# Altium project KIT_ARDUINO_V1.0.PrjPcb
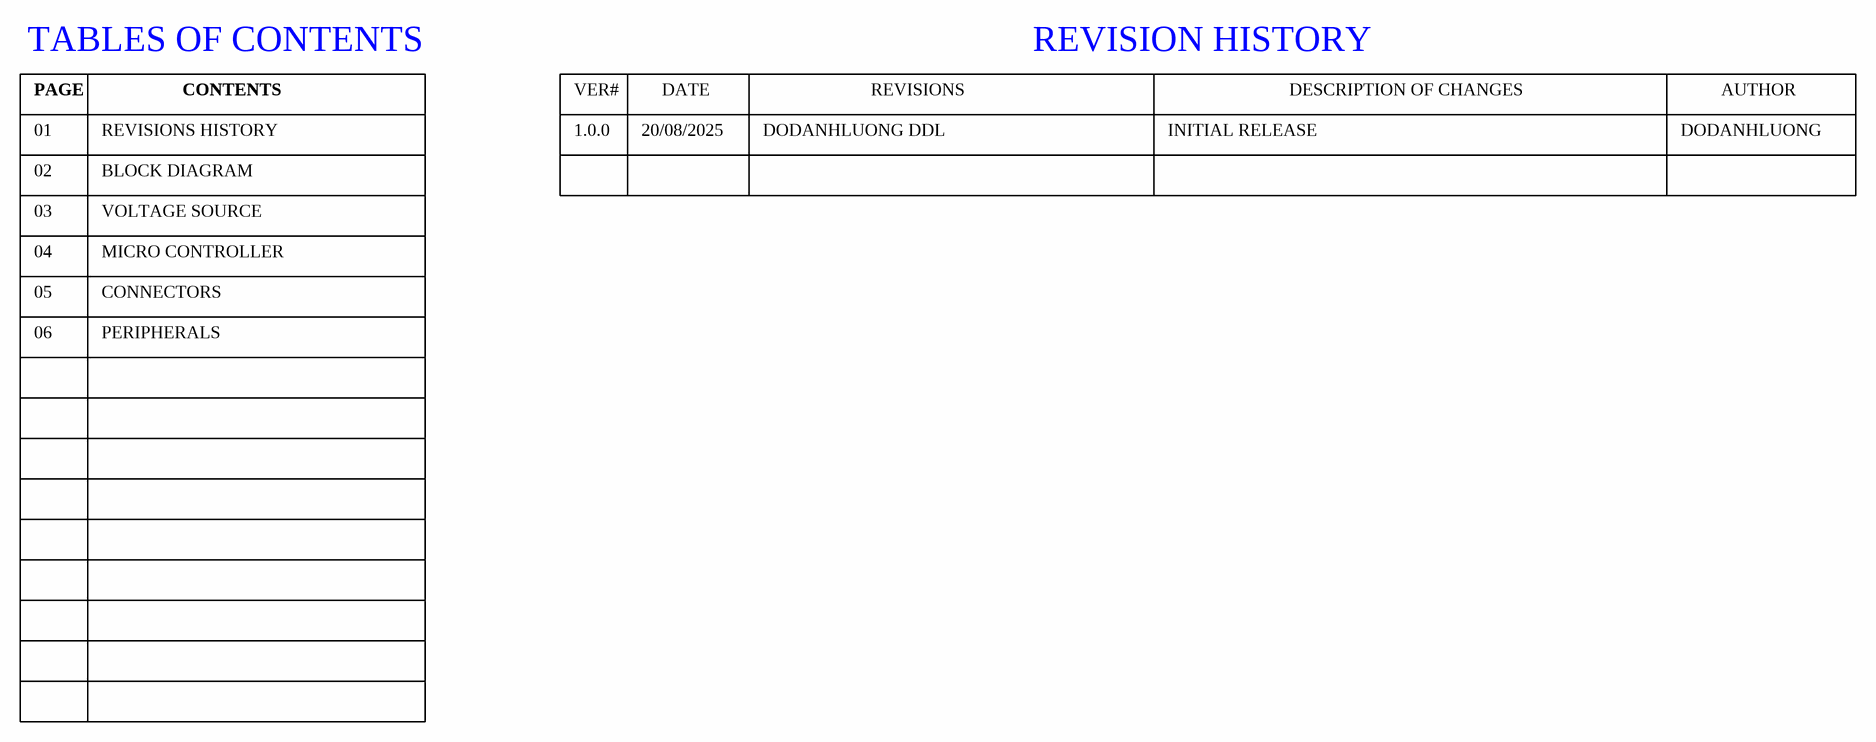
[diagram p0: Revisions History.SchDoc]
6 sheets, 97 parts. Net scope: global (net labels, ports and power ports of the same name join across sheets).
Board files: PCB.PcbDoc, Assembly.PcbDoc
Sheets:
  Revisions History.SchDoc
  Block Diagram.SchDoc
  Voltage Source.SchDoc
  Micro Controller.SchDoc
  Connector.SchDoc
  Peripheral.SchDoc

## Sheet Revisions History.SchDoc: Revisions History
size A3; Author: DODANHLUONG; Revision: 1.0; SheetNumber: 1; SheetTotal: 6; ProjectTitle: KIT ARDUINO VERSION 1.0

### Notes on the sheet
- TABLES OF CONTENTS
- REVISION HISTORY
- PAGE
- 01
- REVISIONS HISTORY
- CONTENTS
- VER#
- 1.0.0
- 20/08/2025
- DATE
- DODANHLUONG DDL
- REVISIONS
- INITIAL RELEASE
- DESCRIPTION OF CHANGES
- DODANHLUONG
- AUTHOR
- 02
- BLOCK DIAGRAM
- 03
- 04
- MICRO CONTROLLER
- VOLTAGE SOURCE
- 05
- 06
- CONNECTORS
- PERIPHERALS
- Author:
- Title:
- Size:
- A3
- Project:
- Revision:
- Modified Date:
- CheckedBy:
- Date:
- SW Version:

## Sheet Block Diagram.SchDoc: Block Diagram
size A4; Author: DODANHLUONG; Revision: 1.0; SheetNumber: 2; SheetTotal: 6; ProjectTitle: KIT ARDUINO VERSION 1.0

### Notes on the sheet
- Author:
- Title:
- Size:
- A4
- Project:
- Approved:
- Revision:
- Modified Date:
- CONFIDENTIAL
- Date:
- SW Version:

## Sheet Voltage Source.SchDoc: Voltage Source
size A4; Author: DODANHLUONG; Revision: 1.0; SheetNumber: 3; SheetTotal: 6; ProjectTitle: KIT ARDUINO VERSION 1.0
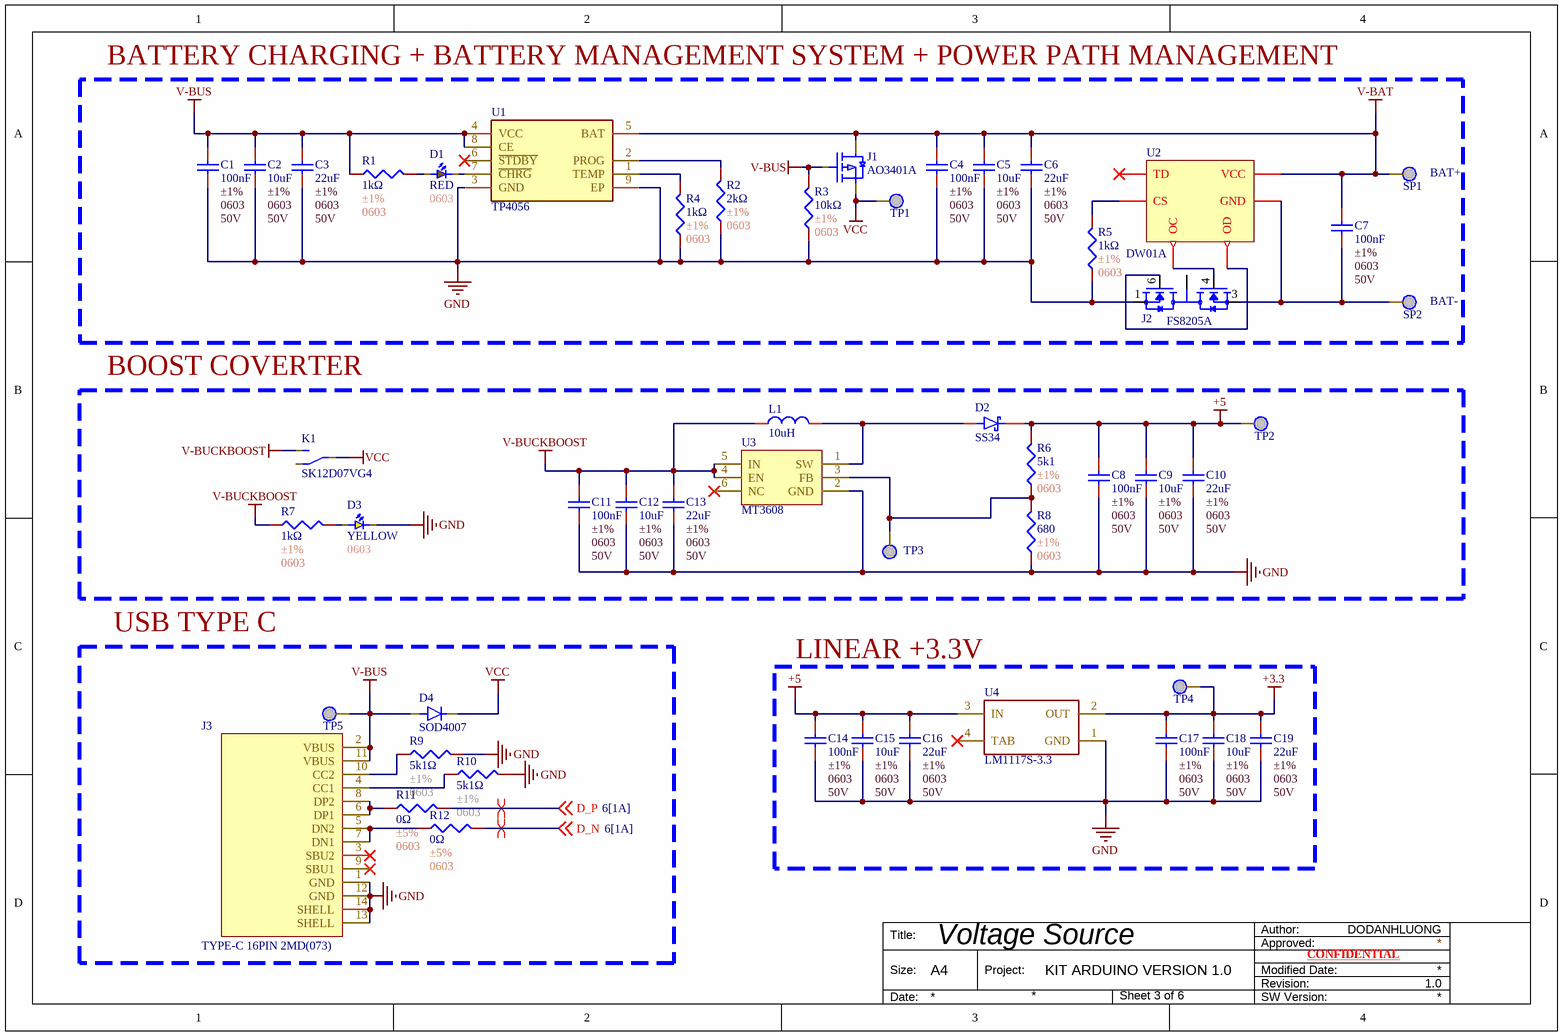
[diagram p1: Voltage Source.SchDoc]

### Parts
C1  100nF  Tolerance: ±1%  Package: 0603  Voltage Rating: 50V  [C0603]
C2  10uF  Tolerance: ±1%  Package: 0603  Voltage Rating: 50V  [C0603]
C3  22uF  Tolerance: ±1%  Package: 0603  Voltage Rating: 50V  [C0603]
C4  100nF  Tolerance: ±1%  Package: 0603  Voltage Rating: 50V  [C0603]
C5  10uF  Tolerance: ±1%  Package: 0603  Voltage Rating: 50V  [C0603]
C6  22uF  Tolerance: ±1%  Package: 0603  Voltage Rating: 50V  [C0603]
C7  100nF  Tolerance: ±1%  Package: 0603  Voltage Rating: 50V  [C0603]
C8  100nF  Tolerance: ±1%  Package: 0603  Voltage Rating: 50V  [C0603]
C9  10uF  Tolerance: ±1%  Package: 0603  Voltage Rating: 50V  [C0603]
C10  22uF  Tolerance: ±1%  Package: 0603  Voltage Rating: 50V  [C0603]
C11  100nF  Tolerance: ±1%  Package: 0603  Voltage Rating: 50V  [C0603]
C12  10uF  Tolerance: ±1%  Package: 0603  Voltage Rating: 50V  [C0603]
C13  22uF  Tolerance: ±1%  Package: 0603  Voltage Rating: 50V  [C0603]
C14  100nF  Tolerance: ±1%  Package: 0603  Voltage Rating: 50V  [C0603]
C15  10uF  Tolerance: ±1%  Package: 0603  Voltage Rating: 50V  [C0603]
C16  22uF  Tolerance: ±1%  Package: 0603  Voltage Rating: 50V  [C0603]
C17  100nF  Tolerance: ±1%  Package: 0603  Voltage Rating: 50V  [C0603]
C18  10uF  Tolerance: ±1%  Package: 0603  Voltage Rating: 50V  [C0603]
C19  22uF  Tolerance: ±1%  Package: 0603  Voltage Rating: 50V  [C0603]
D1  RED  Package: 0603  [LED0603]
D2  SS34  [SS34]
D3  YELLOW  Package: 0603  [LED0603]
D4  SOD4007  [SOD4007]
J1  AO3401A  [AO3401A]
J2  FS8205A  [FS8205A]
J3  TYPE-C 16PIN 2MD(073)  [TYPE_C_FAMALE]
K1  SK12D07VG4  [SK12D07VG4]
L1  10uH  [CD43]
R1  1kΩ  Tolerance: ±1%  Package: 0603  [R0603]
R2  2kΩ  Tolerance: ±1%  Package: 0603  [R0603]
R3  10kΩ  Tolerance: ±1%  Package: 0603  [R0603]
R4  1kΩ  Tolerance: ±1%  Package: 0603  [R0603]
R5  1kΩ  Tolerance: ±1%  Package: 0603  [R0603]
R6  5k1  Tolerance: ±1%  Package: 0603  [R0603]
R7  1kΩ  Tolerance: ±1%  Package: 0603  [R0603]
R8  680  Tolerance: ±1%  Package: 0603  [R0603]
R9  5k1Ω  Tolerance: ±1%  Package: 0603  [R0603]
R10  5k1Ω  Tolerance: ±1%  Package: 0603  [R0603]
R11  0Ω  Tolerance: ±5%  Package: 0603  [R0603]
R12  0Ω  Tolerance: ±5%  Package: 0603  [R0603]
SP1  BAT+  [SP]
SP2  BAT-  [SP]
TP1  TP  [TP]  (value not drawn)
TP2  TP  [TP]  (value not drawn)
TP3  TP  [TP]  (value not drawn)
TP4  TP  [TP]  (value not drawn)
TP5  TP  [TP]  (value not drawn)
U1  TP4056  [TP4056]
U2  DW01A  [DW01A]
U3  MT3608  [MT3608]
U4  LM1117S-3.3  [AMS1117-3.3]

### Blocks framed on the sheet
BOOST COVERTER: C8-C13 D2 D3 K1 L1 R6-R8 TP2 TP3 U3
USB TYPE C: D4 J3 R9-R12 TP5
LINEAR +3.3V: C14-C19 TP4 U4

### Nets
+3.3: C17.1 C18.1 C19.1 TP4.1 U4.2(OUT)
+5: C8.1 C9.1 C10.1 C14.1 C15.1 C16.1 D2.1 R6.2 TP2.1 U4.3(IN)
GND: C1.2 C2.2 C3.2 C4.2 C5.2 C6.2 C8.2 C9.2 C10.2 C11.2 C12.2 C13.2 C14.2 C15.2 C16.2 C17.2 C18.2 C19.2 D3.1 J2.1(S1) J3.1(GND) J3.12(GND) J3.13(SHELL) J3.14(SHELL) R2.1 R3.1 R4.1 R5.1 R8.1 R9.2 R10.2 U1.3(GND) U1.9(EP) U3.2(GND) U4.1(GND)
V-BAT: C4.1 C5.1 C6.1 C7.1 J1.3(D) SP1.1 U1.5(BAT) U2.5(VCC)
V-BUCKBOOST: C11.1 C12.1 C13.1 K1.1 L1.1 R7.1 U3.4(EN) U3.5(IN)
V-BUS: C1.1 C2.1 C3.1 D4.2(A) J1.1(G) J3.2(VBUS) J3.11(VBUS) R1.1 R3.2 TP5.1 U1.4(VCC) U1.8(CE)
VCC: D4.1(C) J1.2(S) K1.2 TP1.1
D_N: R12.2 ; off-sheet D_N
D_P: R11.2 ; off-sheet D_P
NetC7_2: C7.2 J2.3(S2) SP2.1 U2.6(GND)
NetD1_1: D1.1 U1.7(~{CHRG})
NetD1_2: D1.2 R1.2
NetD2_2: D2.2 L1.2 U3.1(SW)
NetD3_2: D3.2 R7.2
NetJ2_2: J2.2(D12) J2.5(D12)
NetJ2_4: J2.4(G2) U2.3(OC)
NetJ2_6: J2.6(G1) U2.1(OD)
NetJ3_4: J3.4(CC1) R10.1
NetJ3_5: J3.5(DN2) J3.7(DN1) R12.1
NetJ3_6: J3.6(DP1) J3.8(DP2) R11.1
NetJ3_10: J3.10(CC2) R9.1
NetR2_2: R2.2 U1.2(PROG)
NetR4_2: R4.2 U1.1(TEMP)
NetR5_2: R5.2 U2.2(CS)
NetR6_1: R6.1 R8.2 TP3.1 U3.3(FB)

Not connected (* = marked no-connect by the designer): J3 3(SBU2)* 9(SBU1)*; K1 3; U1 6(~{STDBY})*; U2 4(TD)*; U3 6(NC)*; U4 4(TAB)*

### Layout directives
differential pair: D_N, D_P

### Notes on the sheet
- BATTERY CHARGING + BATTERY MANAGEMENT SYSTEM + POWER PATH MANAGEMENT
- Author:
- Title:
- Size:
- A4
- Project:
- Approved:
- Revision:
- Modified Date:
- CONFIDENTIAL
- Date:
- SW Version:

### Library data of the parts
C1 C4 C7 C8 C11 C14 C17 = C0603_100nF_±1%: 50V 10pF NP0 ±1% 0402 Multilayer Ceramic Capacitors MLCC - SMD/SMT ROHS; Manufacturer: YAGEO; Mfr. Part #: CC0402FRNPO9BN100; LCSC Part #: C513681; Link: https://www.lcsc.com/product-detail/C513681.html?s_z=n_capital%2520yageo%252010pF%25200402; Capacitance: 100nF
C2 C5 C9 C12 C15 C18 = C0603_10uF_±1%: 50V 10pF NP0 ±1% 0402 Multilayer Ceramic Capacitors MLCC - SMD/SMT ROHS; Manufacturer: YAGEO; Mfr. Part #: CC0402FRNPO9BN100; LCSC Part #: C513681; Link: https://www.lcsc.com/product-detail/C513681.html?s_z=n_capital%2520yageo%252010pF%25200402; Capacitance: 10uF
C3 C6 C10 C13 C16 C19 = C0603_22uF_±1%: 50V 10pF NP0 ±1% 0402 Multilayer Ceramic Capacitors MLCC - SMD/SMT ROHS; Manufacturer: YAGEO; Mfr. Part #: CC0402FRNPO9BN100; LCSC Part #: C513681; Link: https://www.lcsc.com/product-detail/C513681.html?s_z=n_capital%2520yageo%252010pF%25200402; Capacitance: 22uF
D1 = D0603_RED: 25mcd~40mcd Water Clear -40℃~+85℃ 624nm Red 120° 60mW 0402 LED Indication - Discrete ROHS; Manufacturer: XINGLIGHT; Mfr. Part #: XL-1005UGC; Voltage - Forward(Vf): 3V; LCSC Part #: C965793; Power(Watts): 60mW; Link: https://www.lcsc.com/product-detail/C136765.html?s_z=n_LED%25200402%2520RED; Illumination Color: RED
D2 = SS34: 40V Independent 3A 550mV@3A SMA(DO-214AC) Schottky Diodes ROHS; Manufacturer: MDD(Microdiode Semiconductor); Mfr. Part #: SS34; LCSC Part #: C8678; Package: SMA(DO-214AC); Voltage - DC Reverse(Vr): 40V; Current - Rectified: 3A; Link: https://www.lcsc.com/product-detail/C8678.html?s_z=n_SS34
D3 = D0603_YELLOW: 25mcd~40mcd Water Clear -40℃~+85℃ 624nm Red 120° 60mW 0402 LED Indication - Discrete ROHS; Manufacturer: XINGLIGHT; Mfr. Part #: XL-1005UGC; Voltage - Forward(Vf): 3V; LCSC Part #: C965793; Power(Watts): 60mW; Link: https://www.lcsc.com/product-detail/C136765.html?s_z=n_LED%25200402%2520RED; Illumination Color: YELLOW
D4 = SOD4007: 1A Independent 1kV 1.1V@1A SOD-123FL Diodes - General Purpose ROHS; Manufacturer: MDD(Microdiode Semiconductor); Mfr. Part #: SOD4007; Package: SOD-123FL; LCSC Part #: C18124; Link: https://www.lcsc.com/product-detail/C18124.html?s_z=n_SOD4007; Voltage - DC Reverse(Vr): 1kV; Current - Rectified: 1A
J1 = AO3401: 30V 4A 900mV@250uA 1 P-Channel SOT-23 MOSFETs ROHS; Manufacturer: AOS; Mfr. Part #: AO3401A; LCSC Part #: C15127; Package: SOT-23; Current - Continuous Drain(Id): 4A; Drain to Source Voltage: 30V; Link: https://www.lcsc.com/product-detail/C15127.html?s_z=n_AO3401
J2 = FS8205A: 20V 9A 31.5mΩ@2.5V 1.5W 1.2V@250uA SOT-23-6 MOSFETs ROHS; Manufacturer: TECH PUBLIC; Mfr. Part #: FS8205A; Package: SOT-23-6; LCSC Part #: C2830320; Drain to Source Voltage: 20V; Current - Continuous Drain(Id): 9A; Link: https://www.lcsc.com/product-detail/C2830320.html?s_z=n_fs8205a
J3 = TYPE_C_FAMALE_16PIN: 3A 1 Surface Mount, Right Angle 16P Female -25℃~+85℃ Type-C SMD USB Connectors ROHS; Manufacturer: SHOU HAN; Mfr. Part #: TYPE-C 16PIN 2MD(073); LCSC Part #: C2765186; Package: SMD; Number of Contacts: 16P; Link: https://www.lcsc.com/product-detail/C2765186.html?s_z=n_type%2520c
K1 = SK12D07VG4: 500mA SPDT 50V 5,000 Cycles Through Hole Slide Switches ROHS; Manufacturer: SHOU HAN; Switch Height: 8.8mm; Mfr. Part #: SK12D07VG4; LCSC Part #: C393937; Package: Through Hole; Link: https://www.lcsc.com/product-detail/C393937.html?s_z=n_SK12D07VG4
L1 = CD4-10UH: 1.15A 10uH Unshielded Inductor ±20% SMD,4x4.5mm Power Inductors ROHS; Manufacturer: ZE; Mfr. Part #: CD43-100M; Key Attributes: FIXED IND 10uH 1.15A 182mΩ SMD,4x4.5mm; DC Resistance(DCR): 182mΩ; LCSC Part #: C18734467; Package: SMD,4x4.5mm; Link: https://www.lcsc.com/product-detail/C18734467.html?s_z=n_CD43%252010uH; Tolerance: ±20%; Current Rating: 1.15A; Inductance: 10uH
R1 R4 R5 R7 = R0603_1kΩ_±1%: 62.5mW Thick Film Resistor 50V ±1% ±200ppm/℃ 10Ω 0402 Chip Resistor - Surface Mount ROHS; Manufacturer: YAGEO; Mfr. Part #: RC0402FR-0710RL; LCSC Part #: C138066; Resistance: 1kΩ; Link: https://www.lcsc.com/product-detail/C138066.html?s_z=n_resistor%25200402%252010R
R2 = R0603_2kΩ_±1%: 62.5mW Thick Film Resistor 50V ±1% ±200ppm/℃ 10Ω 0402 Chip Resistor - Surface Mount ROHS; Manufacturer: YAGEO; Mfr. Part #: RC0402FR-0710RL; LCSC Part #: C138066; Resistance: 2kΩ; Link: https://www.lcsc.com/product-detail/C138066.html?s_z=n_resistor%25200402%252010R
R3 = R0603_10kΩ_±1%: 62.5mW Thick Film Resistor 50V ±1% ±200ppm/℃ 10Ω 0402 Chip Resistor - Surface Mount ROHS; Manufacturer: YAGEO; Mfr. Part #: RC0402FR-0710RL; LCSC Part #: C138066; Resistance: 10kΩ; Link: https://www.lcsc.com/product-detail/C138066.html?s_z=n_resistor%25200402%252010R
R6 = R0603_10kΩ_±1%: 62.5mW Thick Film Resistor 50V ±1% ±200ppm/℃ 10Ω 0402 Chip Resistor - Surface Mount ROHS; Manufacturer: YAGEO; Mfr. Part #: RC0402FR-0710RL; Resistance: 10kΩ; LCSC Part #: C138066; Link: https://www.lcsc.com/product-detail/C138066.html?s_z=n_resistor%25200402%252010R
R8 = R0603_2kΩ_±1%: 62.5mW Thick Film Resistor 50V ±1% ±200ppm/℃ 10Ω 0402 Chip Resistor - Surface Mount ROHS; Manufacturer: YAGEO; Mfr. Part #: RC0402FR-0710RL; Resistance: 2kΩ; LCSC Part #: C138066; Link: https://www.lcsc.com/product-detail/C138066.html?s_z=n_resistor%25200402%252010R
R9 R10 = R0603_5k1Ω_±1%: 100mW Thick Film Resistor 75V ±100ppm/℃ ±1% 5.1kΩ 0603 Chip Resistor - Surface Mount ROHS; Manufacturer: FOJAN; Mfr. Part #: FRC0603F5101TS; Key Attributes: RES 5.1kΩ ±1% 100mW 0603; LCSC Part #: C2907044; Link: https://www.lcsc.com/product-detail/C2907044.html?s_z=n_5k1%25200603; Resistance: 5k1Ω
R11 R12 = R0603_0Ω_±5%: 100mW Thick Film Resistor 75V ±5% 0Ω 0603 Chip Resistor - Surface Mount ROHS; Manufacturer: YAGEO; Mfr. Part #: RC0603JR-070RL; Key Attributes: RES 0Ω ±5% 100mW 0603; LCSC Part #: C95177; Resistance: 0Ω; Link: https://www.lcsc.com/product-detail/C138066.html?s_z=n_resistor%25200402%252010R
SP1 SP2 = SP
U1 = TP4056: 4V~6V Lithium-ion/Polymer 1 ESOP-8 Battery Management ROHS; Manufacturer: TPOWER; Key Attributes: 1A Lithium Battery Charger; Number of Cells: 1; Charging Saturation Voltage: 4.2V; Mfr. Part #: TP4056; LCSC Part #: C382139; Package: ESOP-8; Voltage - Supply: 4V~6V; Link: https://www.lcsc.com/product-detail/C382139.html?s_z=n_TP4056
U2 = DW01A: 1.5V~8V Lithium-ion/Polymer 1 SOT-23-6 Battery Management ROHS; Manufacturer: YONGYUTAI; Key Attributes: Lithium battery protection circuit; Charging Saturation Voltage: 4.3V; Mfr. Part #: DW01A; LCSC Part #: C2927799; Package: SOT-23-6; Voltage - Supply: 1.5V~8V; Link: https://www.lcsc.com/product-detail/C2927799.html?s_z=n_DW-01A
U3 = MT3608: Boost Adjustable 2A 2V~24V SOT-23-6 DC-DC Converters ROHS; Manufacturer: XI'AN Aerosemi Tech; Frequency - Switching: 1.2MHz; Mfr. Part #: MT3608; LCSC Part #: C84817; Package: SOT-23-6; Function: Boost; Link: https://www.lcsc.com/product-detail/C84817.html?s_z=n_mt3608
U4 = LM1117S-3.3: 75dB@(120Hz) 1A Fixed 3.3V Positive 12V SOT-223-3 Voltage Regulators - Linear, Low Drop Out (LDO) Regulators ROHS; Manufacturer: HTC; Noise: 100uV; Mfr. Part #: LM1117S-3.3; LCSC Part #: C126027; Package: SOT-223-3; Output Current: 1A; Voltage - Supply: 12V; Link: https://www.lcsc.com/product-detail/C126027.html?s_z=n_lm1117-33

## Sheet Micro Controller.SchDoc: Micro Controller
size A4; Author: DODANHLUONG; Revision: 1.0; SheetNumber: 4; SheetTotal: 6; ProjectTitle: KIT ARDUINO VERSION 1.0
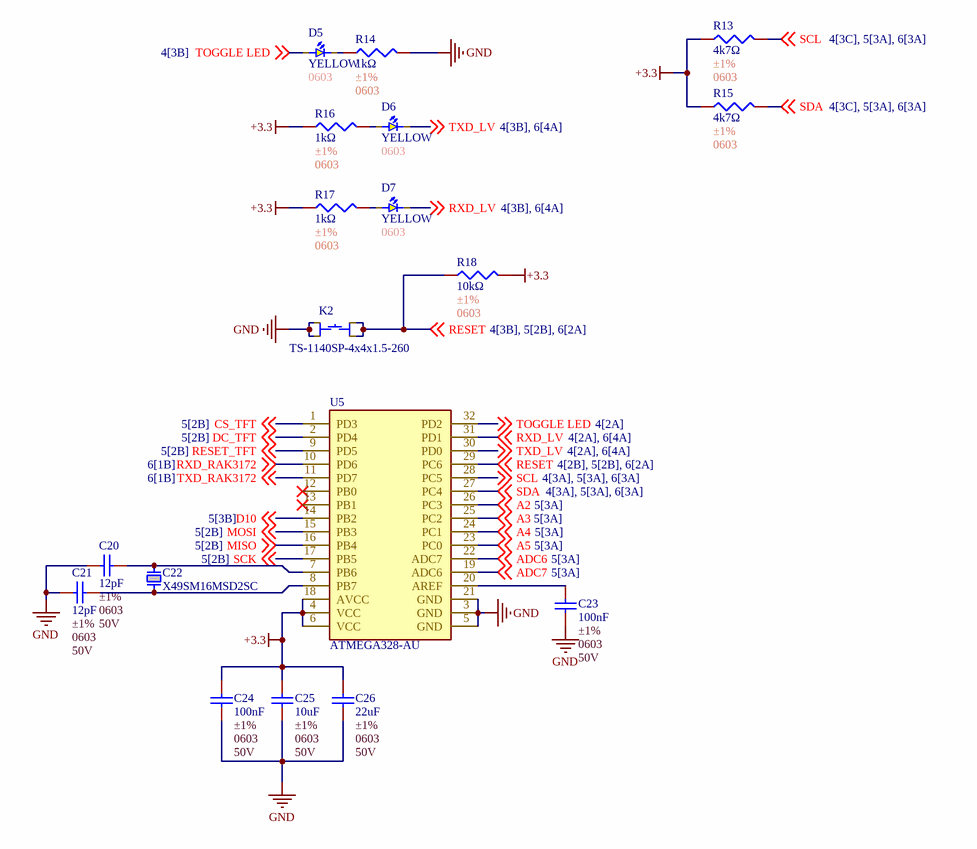
[diagram p2: Micro Controller.SchDoc]

### Parts
C20  12pF  Tolerance: ±1%  Package: 0603  Voltage Rating: 50V  [C0603]
C21  12pF  Tolerance: ±1%  Package: 0603  Voltage Rating: 50V  [C0603]
C22  X49SM16MSD2SC  [X49SM16MSD2SC]
C23  100nF  Tolerance: ±1%  Package: 0603  Voltage Rating: 50V  [C0603]
C24  100nF  Tolerance: ±1%  Package: 0603  Voltage Rating: 50V  [C0603]
C25  10uF  Tolerance: ±1%  Package: 0603  Voltage Rating: 50V  [C0603]
C26  22uF  Tolerance: ±1%  Package: 0603  Voltage Rating: 50V  [C0603]
D5  YELLOW  Package: 0603  [LED0603]
D6  YELLOW  Package: 0603  [LED0603]
D7  YELLOW  Package: 0603  [LED0603]
K2  TS-1140SP-4x4x1.5-260  [4x4x1.5]
R13  4k7Ω  Tolerance: ±1%  Package: 0603  [R0603]
R14  1kΩ  Tolerance: ±1%  Package: 0603  [R0603]
R15  4k7Ω  Tolerance: ±1%  Package: 0603  [R0603]
R16  1kΩ  Tolerance: ±1%  Package: 0603  [R0603]
R17  1kΩ  Tolerance: ±1%  Package: 0603  [R0603]
R18  10kΩ  Tolerance: ±1%  Package: 0603  [R0603]
U5  ATMEGA328-AU  [ATMEGA328-AU]

### Nets
+3.3: C24.1 C25.1 C26.1 R13.1 R15.1 R16.1 R17.1 R18.2 U5.4(VCC) U5.6(VCC) U5.18(AVCC)
GND: C20.2 C21.2 C23.2 C24.2 C25.2 C26.2 K2.1 K2.3 R14.2 U5.3(GND) U5.5(GND) U5.21(GND)
A2: U5.26(PC3) ; off-sheet A2
A3: U5.25(PC2) ; off-sheet A3
A4: U5.24(PC1) ; off-sheet A4
A5: U5.23(PC0) ; off-sheet A5
ADC6: U5.22(ADC7) ; off-sheet ADC6
ADC7: U5.19(ADC6) ; off-sheet ADC7
CS_TFT: U5.1(PD3) ; off-sheet CS_TFT
D10: U5.14(PB2) ; off-sheet D10
DC_TFT: U5.2(PD4) ; off-sheet DC_TFT
MISO: U5.16(PB4) ; off-sheet MISO
MOSI: U5.15(PB3) ; off-sheet MOSI
RESET: K2.2 K2.4 R18.1 U5.29(PC6) ; off-sheet RESET
RESET_TFT: U5.9(PD5) ; off-sheet RESET_TFT
RXD_LV: D7.1 U5.31(PD1) ; off-sheet RXD_LV
RXD_RAK3172: U5.10(PD6) ; off-sheet RXD_RAK3172
SCK: U5.17(PB5) ; off-sheet SCK
SCL: R13.2 U5.28(PC5) ; off-sheet SCL
SDA: R15.2 U5.27(PC4) ; off-sheet SDA
TOGGLE LED: D5.2 U5.32(PD2) ; off-sheet TOGGLE LED
TXD_LV: D6.1 U5.30(PD0) ; off-sheet TXD_LV
TXD_RAK3172: U5.11(PD7) ; off-sheet TXD_RAK3172
NetC20_1: C20.1 C22.2 U5.7(PB6)
NetC21_1: C21.1 C22.1 U5.8(PB7)
NetC23_1: C23.1 U5.20(AREF)
NetD5_1: D5.1 R14.1
NetD6_2: D6.2 R16.2
NetD7_2: D7.2 R17.2

Not connected (* = marked no-connect by the designer): U5 12(PB0)* 13(PB1)*

### Notes on the sheet
- Author:
- Title:
- Size:
- A4
- Project:
- Approved:
- Revision:
- Modified Date:
- CONFIDENTIAL
- Date:
- SW Version:

### Library data of the parts
C20 C21 = C0603_12pF_±1%: 50V 10pF NP0 ±1% 0402 Multilayer Ceramic Capacitors MLCC - SMD/SMT ROHS; Manufacturer: YAGEO; Mfr. Part #: CC0402FRNPO9BN100; LCSC Part #: C513681; Link: https://www.lcsc.com/product-detail/C513681.html?s_z=n_capital%2520yageo%252010pF%25200402; Capacitance: 12pF
C22 = X49SM16MSD2SC: 16MHz Crystal Oscillator 20pF ±20ppm ±30ppm HC-49S-SMD Crystals ROHS; Manufacturer: YXC Crystal Oscillators; Mfr. Part #: X49SM16MSD2SC; LCSC Part #: C12676; Package: HC-49S-SMD; Link: https://www.lcsc.com/product-detail/C12676.html?s_z=n_Crystal%2520Oscillators%2520X49%252016Mhz; Load Capacitance: 20pF
C23 C24 = C0603_100nF_±1%: as C1 on sheet Voltage Source; LCSC Part #: C513681; Link: https://www.lcsc.com/product-detail/C513681.html?s_z=n_capital%2520yageo%252010pF%25200402; Capacitance: 100nF
C25 = C0603_10uF_±1%: as C2 on sheet Voltage Source; LCSC Part #: C513681; Link: https://www.lcsc.com/product-detail/C513681.html?s_z=n_capital%2520yageo%252010pF%25200402; Capacitance: 10uF
C26 = C0603_22uF_±1%: as C3 on sheet Voltage Source; LCSC Part #: C513681; Link: https://www.lcsc.com/product-detail/C513681.html?s_z=n_capital%2520yageo%252010pF%25200402; Capacitance: 22uF
D5-D7 = D0603_YELLOW: as D3 on sheet Voltage Source; LCSC Part #: C965793; Power(Watts): 60mW; Link: https://www.lcsc.com/product-detail/C136765.html?s_z=n_LED%25200402%2520RED; Illumination Color: YELLOW
K2 = TS-1140SP-4x4x1.5-260: SMD Tactile Switches ROHS; Manufacturer: CAX; Mfr. Part #: TS-1140SP-4x4x1.5-260; LCSC Part #: C49023394; Package: SMD; Link: https://www.lcsc.com/product-detail/C49023394.html?s_z=n_button%25204x4
R13 R15 = R0603_4k7Ω_±1%: 62.5mW Thick Film Resistor 50V ±1% ±200ppm/℃ 10Ω 0402 Chip Resistor - Surface Mount ROHS; Manufacturer: YAGEO; Mfr. Part #: RC0402FR-0710RL; LCSC Part #: C138066; Resistance: 4k7Ω; Link: https://www.lcsc.com/product-detail/C138066.html?s_z=n_resistor%25200402%252010R
R14 R16 R17 = R0603_1kΩ_±1%: as R1 on sheet Voltage Source; LCSC Part #: C138066; Resistance: 1kΩ; Link: https://www.lcsc.com/product-detail/C138066.html?s_z=n_resistor%25200402%252010R
R18 = R0603_10kΩ_±1%: as R3 on sheet Voltage Source; LCSC Part #: C138066; Resistance: 10kΩ; Link: https://www.lcsc.com/product-detail/C138066.html?s_z=n_resistor%25200402%252010R
U5 = ATMEGA328-AU: AVR 20MHz TQFP-32(7x7) Microcontrollers (MCU/MPU/SOC) ROHS; Manufacturer: MICROCHIP; Voltage - Supply: 1.8V~5.5V; Program Storage Size: 32KB; ADC (Bit): 10bit; Number of I/O: 23; LCSC Part #: C618731; Package: TQFP-32(7x7); CPU Core: AVR; CPU Maximum Speed: 20MHz; Mfr. Part #: ATMEGA328-AU; Link: https://www.lcsc.com/product-detail/C618731.html?s_z=n_C618731

## Sheet Connector.SchDoc: Connector
size A4; Author: DODANHLUONG; Revision: 1.0; SheetNumber: 5; SheetTotal: 6; ProjectTitle: KIT ARDUINO VERSION 1.0
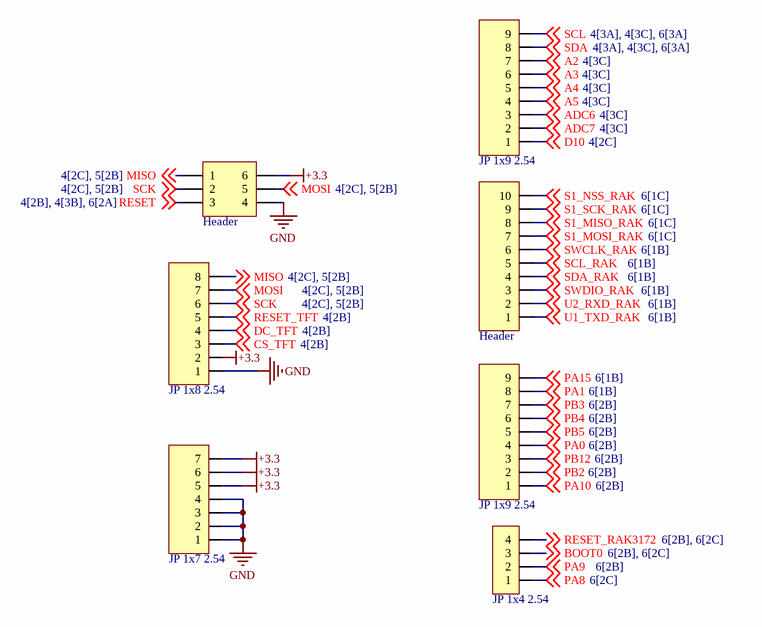
[diagram p3: Connector.SchDoc]

### Parts
JP1  JP 1x9 2.54  [JP 1x9 CT]
JP2  Header  [JP 2x3 DT]
JP3  Header  [JP 1x10 CT]
JP4  JP 1x8 2.54  [JP 1x8 CT]
JP5  JP 1x9 2.54  [JP 1x9 CT]
JP6  JP 1x7 2.54  [JP 1x7 CT]
JP7  JP 1x4 2.54  [JP 1x4 CT]

### Nets
+3.3: JP2.6 JP4.2 JP6.5 JP6.6 JP6.7
GND: JP2.4 JP4.1 JP6.1 JP6.2 JP6.3 JP6.4
A2: JP1.7 ; off-sheet A2
A3: JP1.6 ; off-sheet A3
A4: JP1.5 ; off-sheet A4
A5: JP1.4 ; off-sheet A5
ADC6: JP1.3 ; off-sheet ADC6
ADC7: JP1.2 ; off-sheet ADC7
BOOT0: JP7.3 ; off-sheet BOOT0
CS_TFT: JP4.3 ; off-sheet CS_TFT
D10: JP1.1 ; off-sheet D10
DC_TFT: JP4.4 ; off-sheet DC_TFT
MISO: JP2.1 JP4.8 ; off-sheet MISO
MOSI: JP2.5 JP4.7 ; off-sheet MOSI
PA0: JP5.4 ; off-sheet PA0
PA1: JP5.8 ; off-sheet PA1
PA8: JP7.1 ; off-sheet PA8
PA9: JP7.2 ; off-sheet PA9
PA10: JP5.1 ; off-sheet PA10
PA15: JP5.9 ; off-sheet PA15
PB2: JP5.2 ; off-sheet PB2
PB3: JP5.7 ; off-sheet PB3
PB4: JP5.6 ; off-sheet PB4
PB5: JP5.5 ; off-sheet PB5
PB12: JP5.3 ; off-sheet PB12
RESET: JP2.3 ; off-sheet RESET
RESET_RAK3172: JP7.4 ; off-sheet RESET_RAK3172
RESET_TFT: JP4.5 ; off-sheet RESET_TFT
S1_MISO_RAK: JP3.8 ; off-sheet S1_MISO_RAK
S1_MOSI_RAK: JP3.7 ; off-sheet S1_MOSI_RAK
S1_NSS_RAK: JP3.10 ; off-sheet S1_NSS_RAK
S1_SCK_RAK: JP3.9 ; off-sheet S1_SCK_RAK
SCK: JP2.2 JP4.6 ; off-sheet SCK
SCL: JP1.9 ; off-sheet SCL
SCL_RAK: JP3.5 ; off-sheet SCL_RAK
SDA: JP1.8 ; off-sheet SDA
SDA_RAK: JP3.4 ; off-sheet SDA_RAK
SWCLK_RAK: JP3.6 ; off-sheet SWCLK_RAK
SWDIO_RAK: JP3.3 ; off-sheet SWDIO_RAK
U1_TXD_RAK: JP3.1 ; off-sheet U1_TXD_RAK
U2_RXD_RAK: JP3.2 ; off-sheet U2_RXD_RAK

### Notes on the sheet
- Author:
- Title:
- Size:
- A4
- Project:
- Approved:
- Revision:
- Modified Date:
- CONFIDENTIAL
- Date:
- SW Version:

### Library data of the parts
JP1 JP5 = JP 1x9 2.54 Cai Thang: Cắm; Ten_Linh_Kien: Jump Đơn Cái 2.54MM 1x20P Thẳng; Don_Vi: Con; Ma_Hang: MH004006; Ghi_Chu: *; Kieu_Chan: *; Chung_Loai: Cắm
JP2 = JP 2x3 2.54 Duc Thang: Cắm; Ten_Linh_Kien: Jump Đôi Đực 2.54MM 2x40P Thẳng 11MM; Don_Vi: Con; Ma_Hang: MH002686; Ghi_Chu: *; Kieu_Chan: *; Chung_Loai: Cắm
JP3 = JP 1x10 2.54 Cai Thang: Cắm; Ten_Linh_Kien: Jump Đơn Cái 2.54MM 1x20P Thẳng; Don_Vi: Con; Ma_Hang: MH004006; Ghi_Chu: *; Kieu_Chan: *; Chung_Loai: Cắm
JP4 = JP 1x8 2.54 Cai Thang: Cắm; Ten_Linh_Kien: Jump Đơn Cái 2.54MM 1x20P Thẳng; Don_Vi: Con; Ma_Hang: MH004006; Ghi_Chu: *; Kieu_Chan: *; Chung_Loai: Cắm
JP6 = JP 1x7 2.54 Cai Thang: Cắm; Ten_Linh_Kien: Jump Đơn Cái 2.54MM 1x20P Thẳng; Don_Vi: Con; Ma_Hang: MH004006; Ghi_Chu: *; Kieu_Chan: *; Chung_Loai: Cắm
JP7 = JP 1x4 2.54 Cai Thang: Cắm; Ten_Linh_Kien: Jump Đơn Cái 2.54MM 1x20P Thẳng; Don_Vi: Con; Ma_Hang: MH004006; Ghi_Chu: *; Kieu_Chan: *; Chung_Loai: Cắm

## Sheet Peripheral.SchDoc: Peripheral
size A4; Author: DODANHLUONG; Revision: 1.0; SheetNumber: 6; SheetTotal: 6; ProjectTitle: KIT ARDUINO VERSION 1.0
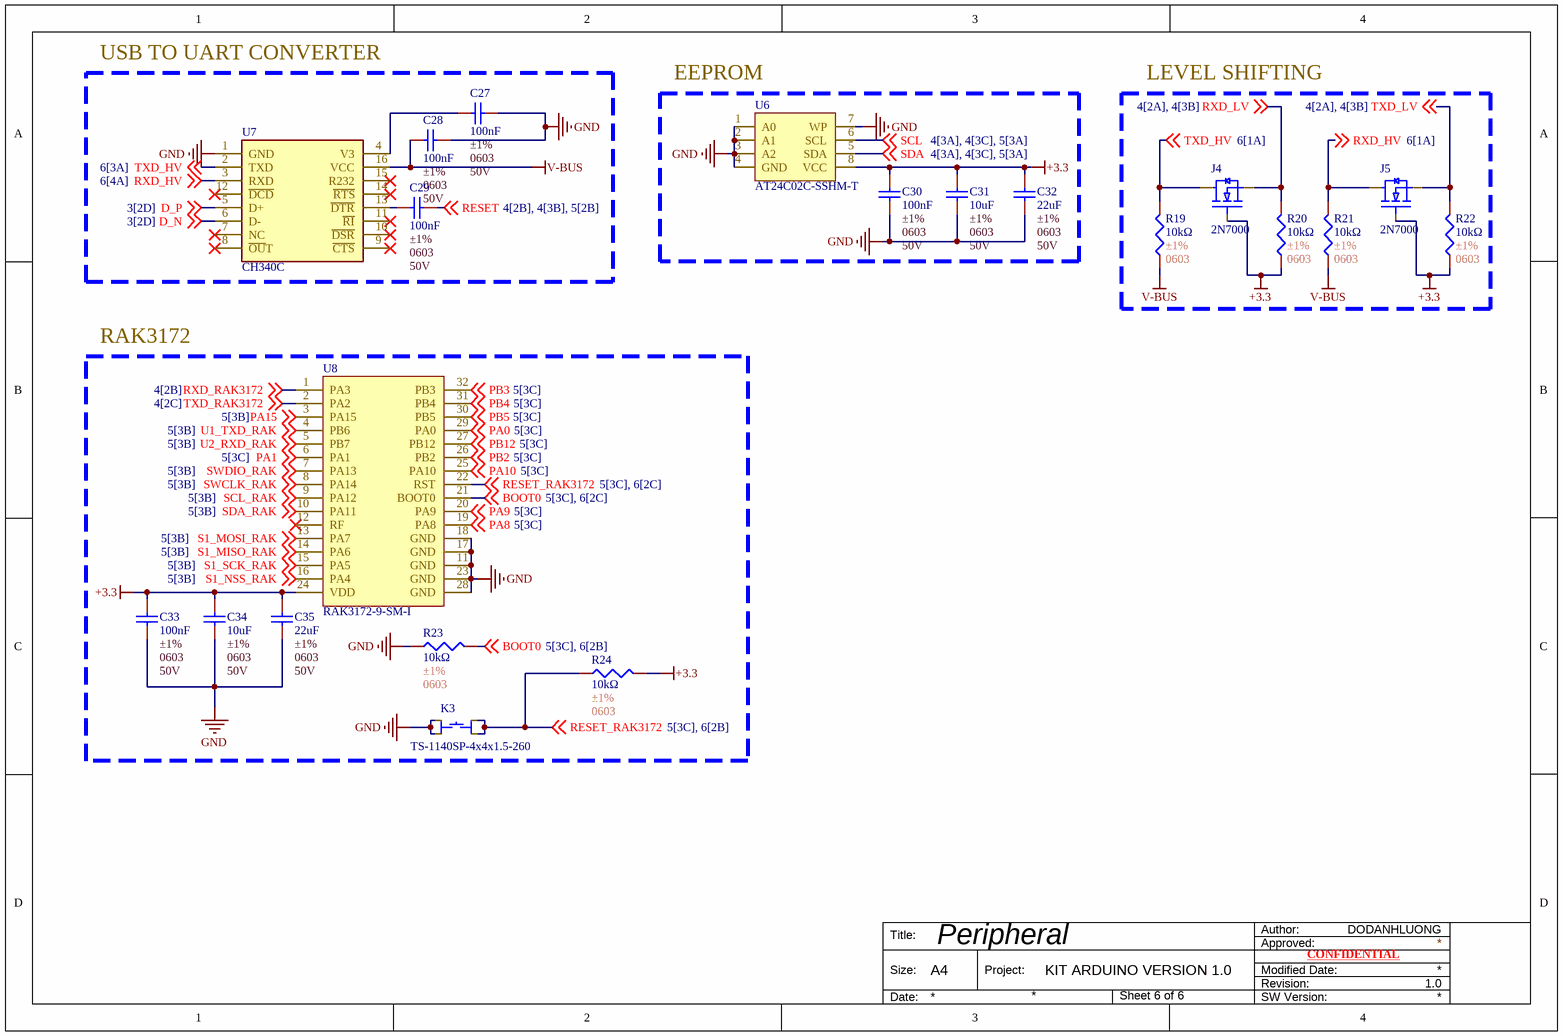
[diagram p4: Peripheral.SchDoc]

### Parts
C27  100nF  Tolerance: ±1%  Package: 0603  Voltage Rating: 50V  [C0603]
C28  100nF  Tolerance: ±1%  Package: 0603  Voltage Rating: 50V  [C0603]
C29  100nF  Tolerance: ±1%  Package: 0603  Voltage Rating: 50V  [C0603]
C30  100nF  Tolerance: ±1%  Package: 0603  Voltage Rating: 50V  [C0603]
C31  10uF  Tolerance: ±1%  Package: 0603  Voltage Rating: 50V  [C0603]
C32  22uF  Tolerance: ±1%  Package: 0603  Voltage Rating: 50V  [C0603]
C33  100nF  Tolerance: ±1%  Package: 0603  Voltage Rating: 50V  [C0603]
C34  10uF  Tolerance: ±1%  Package: 0603  Voltage Rating: 50V  [C0603]
C35  22uF  Tolerance: ±1%  Package: 0603  Voltage Rating: 50V  [C0603]
J4  2N7000  [2N7000]
J5  2N7000  [2N7000]
K3  TS-1140SP-4x4x1.5-260  [4x4x1.5]
R19  10kΩ  Tolerance: ±1%  Package: 0603  [R0603]
R20  10kΩ  Tolerance: ±1%  Package: 0603  [R0603]
R21  10kΩ  Tolerance: ±1%  Package: 0603  [R0603]
R22  10kΩ  Tolerance: ±1%  Package: 0603  [R0603]
R23  10kΩ  Tolerance: ±1%  Package: 0603  [R0603]
R24  10kΩ  Tolerance: ±1%  Package: 0603  [R0603]
U6  AT24C02C-SSHM-T  [AT24C02C-SSHM-T]
U7  CH340C  [CH340C]
U8  RAK3172-9-SM-I  [RAK3172-9-SM-I]

### Blocks framed on the sheet
USB TO UART CONVERTER: C27-C29 U7
EEPROM: C30-C32 U6
LEVEL SHIFTING: J4 J5 R19-R22
RAK3172: C33-C35 K3 R23 R24 U8

### Nets
+3.3: C30.1 C31.1 C32.1 C33.1 C34.1 C35.1 J4.2(G) J5.2(G) R20.1 R22.1 R24.2 U6.8(VCC) U8.24(VDD)
GND: C27.2 C28.2 C30.2 C31.2 C32.2 C33.2 C34.2 C35.2 K3.1 K3.3 R23.1 U6.1(A0) U6.2(A1) U6.3(A2) U6.4(GND) U6.7(WP) U7.1(GND) U8.11(GND) U8.17(GND) U8.18(GND) U8.23(GND) U8.28(GND)
V-BUS: C28.1 R19.1 R21.1 U7.16(VCC)
BOOT0: R23.2 U8.21(BOOT0) ; off-sheet BOOT0
D_N: U7.6(D-) ; off-sheet D_N
D_P: U7.5(D+) ; off-sheet D_P
PA0: U8.29(PA0) ; off-sheet PA0
PA1: U8.6(PA1) ; off-sheet PA1
PA8: U8.19(PA8) ; off-sheet PA8
PA9: U8.20(PA9) ; off-sheet PA9
PA10: U8.25(PA10) ; off-sheet PA10
PA15: U8.3(PA15) ; off-sheet PA15
PB2: U8.26(PB2) ; off-sheet PB2
PB3: U8.32(PB3) ; off-sheet PB3
PB4: U8.31(PB4) ; off-sheet PB4
PB5: U8.30(PB5) ; off-sheet PB5
PB12: U8.27(PB12) ; off-sheet PB12
RESET: C29.2 ; off-sheet RESET
RESET_RAK3172: K3.2 K3.4 R24.1 U8.22(RST) ; off-sheet RESET_RAK3172
RXD_HV: J5.3(D) R21.2 U7.3(RXD) ; off-sheet RXD_HV
RXD_LV: J4.1(S) R20.2 ; off-sheet RXD_LV
RXD_RAK3172: U8.1(PA3) ; off-sheet RXD_RAK3172
S1_MISO_RAK: U8.14(PA6) ; off-sheet S1_MISO_RAK
S1_MOSI_RAK: U8.13(PA7) ; off-sheet S1_MOSI_RAK
S1_NSS_RAK: U8.16(PA4) ; off-sheet S1_NSS_RAK
S1_SCK_RAK: U8.15(PA5) ; off-sheet S1_SCK_RAK
SCL: U6.6(SCL) ; off-sheet SCL
SCL_RAK: U8.9(PA12) ; off-sheet SCL_RAK
SDA: U6.5(SDA) ; off-sheet SDA
SDA_RAK: U8.10(PA11) ; off-sheet SDA_RAK
SWCLK_RAK: U8.8(PA14) ; off-sheet SWCLK_RAK
SWDIO_RAK: U8.7(PA13) ; off-sheet SWDIO_RAK
TXD_HV: J4.3(D) R19.2 U7.2(TXD) ; off-sheet TXD_HV
TXD_LV: J5.1(S) R22.2 ; off-sheet TXD_LV
TXD_RAK3172: U8.2(PA2) ; off-sheet TXD_RAK3172
U1_TXD_RAK: U8.4(PB6) ; off-sheet U1_TXD_RAK
U2_RXD_RAK: U8.5(PB7) ; off-sheet U2_RXD_RAK
NetC27_1: C27.1 U7.4(V3)
NetC29_1: C29.1 U7.13(~{DTR})

Not connected (* = marked no-connect by the designer): U7 7(NC)* 8(~{OU}T)* 9(~{CTS})* 10(~{DSR})* 11(~{RI})* 12(~{DCD})* 14(~{RTS})* 15(R232)*; U8 12(RF)*

### Notes on the sheet
- Author:
- Title:
- Size:
- A4
- Project:
- Approved:
- Revision:
- Modified Date:
- CONFIDENTIAL
- Date:
- SW Version:

### Library data of the parts
C27-C30 C33 = C0603_100nF_±1%: as C1 on sheet Voltage Source; LCSC Part #: C513681; Link: https://www.lcsc.com/product-detail/C513681.html?s_z=n_capital%2520yageo%252010pF%25200402; Capacitance: 100nF
C31 C34 = C0603_10uF_±1%: as C2 on sheet Voltage Source; LCSC Part #: C513681; Link: https://www.lcsc.com/product-detail/C513681.html?s_z=n_capital%2520yageo%252010pF%25200402; Capacitance: 10uF
C32 C35 = C0603_22uF_±1%: as C3 on sheet Voltage Source; LCSC Part #: C513681; Link: https://www.lcsc.com/product-detail/C513681.html?s_z=n_capital%2520yageo%252010pF%25200402; Capacitance: 22uF
J4 J5 = 2N7000: 60V 200mA 400mW 5Ω@10V 3V@1mA 1 N-Channel TO-92-3L MOSFETs ROHS; Manufacturer: onsemi; Mfr. Part #: 2N7000; LCSC Part #: C232838; Package: TO-92-3L; Current - Continuous Drain(Id): 200mA; Drain to Source Voltage: 60V; Link: https://www.lcsc.com/product-detail/C232838.html?s_z=n_2n7000; Gate Threshold Voltage (Vgs(th)): 3V@1mA; RDS(on): 5Ω@10V; Type: N-Channel
K3 = TS-1140SP-4x4x1.5-260: as K2 on sheet Micro Controller; Mfr. Part #: TS-1140SP-4x4x1.5-260; LCSC Part #: C49023394; Package: SMD; Link: https://www.lcsc.com/product-detail/C49023394.html?s_z=n_button%25204x4
R19-R24 = R0603_10kΩ_±1%: as R3 on sheet Voltage Source; LCSC Part #: C138066; Resistance: 10kΩ; Link: https://www.lcsc.com/product-detail/C138066.html?s_z=n_resistor%25200402%252010R
U6 = AT24C02C-SSHM-T: 2Kbit 1MHz I2C SOIC-8 EEPROM ROHS; Manufacturer: MICROCHIP; Key Attributes: I²C-Compatible (2-wire) Serial EEPROM; Write Cycle Endurance: 1,000,000 Cycles; Voltage - Supply: 1.7V~5.5V; Mfr. Part #: AT24C02C-SSHM-T; LCSC Part #: C6203; Package: SOIC-8; Link: https://www.lcsc.com/product-detail/C6203.html?s_z=n_24C02; Interface: I2C; Memory Size: 2Kbit
U7 = CH340C: 2Mbps Transceiver USB 2.0 SOP-16 USB Converters ROHS; Manufacturer: WCH; Voltage - Supply: 3.3V;5V; LCSC Part #: C84681; Package: SOP-16; Link: https://www.lcsc.com/product-detail/C84681.html?s_z=n_CH340C; Mfr. Part #: CH340C
U8 = RAK3172-9-SM-I: 15km SMD,15.5x15mm LoRa Modules ROHS; Manufacturer: RAKwireless; Key Attributes: WisDuo LPWAN Module; Voltage - Supply: 2V~3.6V; Antenna Type: IPEX Connector; Interface Type: UART;SPI;I2C; Package: SMD,15.5x15mm; LCSC Part #: C19723905; Mfr. Part #: RAK3172-9-SM-I; Link: https://www.lcsc.com/product-detail/C19723905.html?s_z=n_RAK3172

## Nets that join several sheets
+3.3: Voltage Source (5 pins), Micro Controller (11 pins), Connector (5 pins), Peripheral (13 pins)
GND: Voltage Source (35 pins), Micro Controller (12 pins), Connector (6 pins), Peripheral (22 pins)
V-BUS: Voltage Source (12 pins), Peripheral (C28.1 R19.1 R21.1 U7.16)
A2: Micro Controller (U5.26), Connector (JP1.7)
A3: Micro Controller (U5.25), Connector (JP1.6)
A4: Micro Controller (U5.24), Connector (JP1.5)
A5: Micro Controller (U5.23), Connector (JP1.4)
ADC6: Micro Controller (U5.22), Connector (JP1.3)
ADC7: Micro Controller (U5.19), Connector (JP1.2)
BOOT0: Connector (JP7.3), Peripheral (R23.2 U8.21)
CS_TFT: Micro Controller (U5.1), Connector (JP4.3)
D10: Micro Controller (U5.14), Connector (JP1.1)
D_N: Voltage Source (R12.2), Peripheral (U7.6)
D_P: Voltage Source (R11.2), Peripheral (U7.5)
DC_TFT: Micro Controller (U5.2), Connector (JP4.4)
MISO: Micro Controller (U5.16), Connector (JP2.1 JP4.8)
MOSI: Micro Controller (U5.15), Connector (JP2.5 JP4.7)
PA0: Connector (JP5.4), Peripheral (U8.29)
PA1: Connector (JP5.8), Peripheral (U8.6)
PA8: Connector (JP7.1), Peripheral (U8.19)
PA9: Connector (JP7.2), Peripheral (U8.20)
PA10: Connector (JP5.1), Peripheral (U8.25)
PA15: Connector (JP5.9), Peripheral (U8.3)
PB2: Connector (JP5.2), Peripheral (U8.26)
PB3: Connector (JP5.7), Peripheral (U8.32)
PB4: Connector (JP5.6), Peripheral (U8.31)
PB5: Connector (JP5.5), Peripheral (U8.30)
PB12: Connector (JP5.3), Peripheral (U8.27)
RESET: Micro Controller (K2.2 K2.4 R18.1 U5.29), Connector (JP2.3), Peripheral (C29.2)
RESET_RAK3172: Connector (JP7.4), Peripheral (K3.2 K3.4 R24.1 U8.22)
RESET_TFT: Micro Controller (U5.9), Connector (JP4.5)
RXD_LV: Micro Controller (D7.1 U5.31), Peripheral (J4.1 R20.2)
RXD_RAK3172: Micro Controller (U5.10), Peripheral (U8.1)
S1_MISO_RAK: Connector (JP3.8), Peripheral (U8.14)
S1_MOSI_RAK: Connector (JP3.7), Peripheral (U8.13)
S1_NSS_RAK: Connector (JP3.10), Peripheral (U8.16)
S1_SCK_RAK: Connector (JP3.9), Peripheral (U8.15)
SCK: Micro Controller (U5.17), Connector (JP2.2 JP4.6)
SCL: Micro Controller (R13.2 U5.28), Connector (JP1.9), Peripheral (U6.6)
SCL_RAK: Connector (JP3.5), Peripheral (U8.9)
SDA: Micro Controller (R15.2 U5.27), Connector (JP1.8), Peripheral (U6.5)
SDA_RAK: Connector (JP3.4), Peripheral (U8.10)
SWCLK_RAK: Connector (JP3.6), Peripheral (U8.8)
SWDIO_RAK: Connector (JP3.3), Peripheral (U8.7)
TXD_LV: Micro Controller (D6.1 U5.30), Peripheral (J5.1 R22.2)
TXD_RAK3172: Micro Controller (U5.11), Peripheral (U8.2)
U1_TXD_RAK: Connector (JP3.1), Peripheral (U8.4)
U2_RXD_RAK: Connector (JP3.2), Peripheral (U8.5)